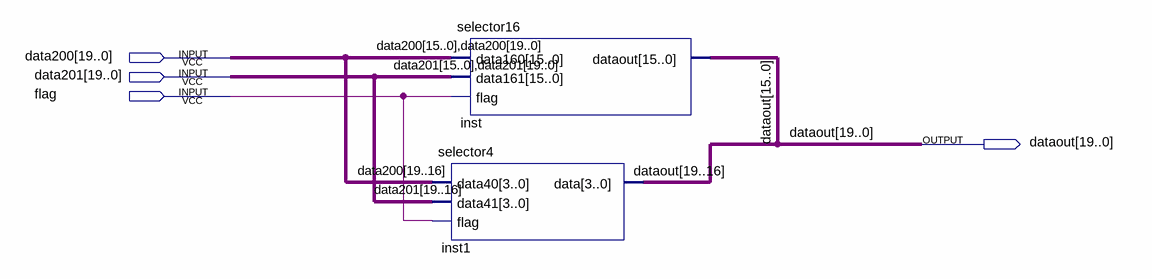
[diagram p0: schematic sheet]
// Quartus schematic selector20.bdf as structural Verilog: 2 symbols, 4 pins
module selector20 (
  input  [19:0] data200,
  input  [19:0] data201,
  input  flag,
  output [19:0] dataout
);

  selector16 inst (
    .data160({data200[15:0], data200}), .data161({data201[15:0], data201}), .flag(flag),
    .dataout(dataout[15:0]));
  selector4 inst1 (.data40(data200[19:16]), .data41(data201[19:16]), .flag(flag), .data(dataout[19:16]));
endmodule
